# EAGLE design smartsensor (EAGLE 7.4.0)
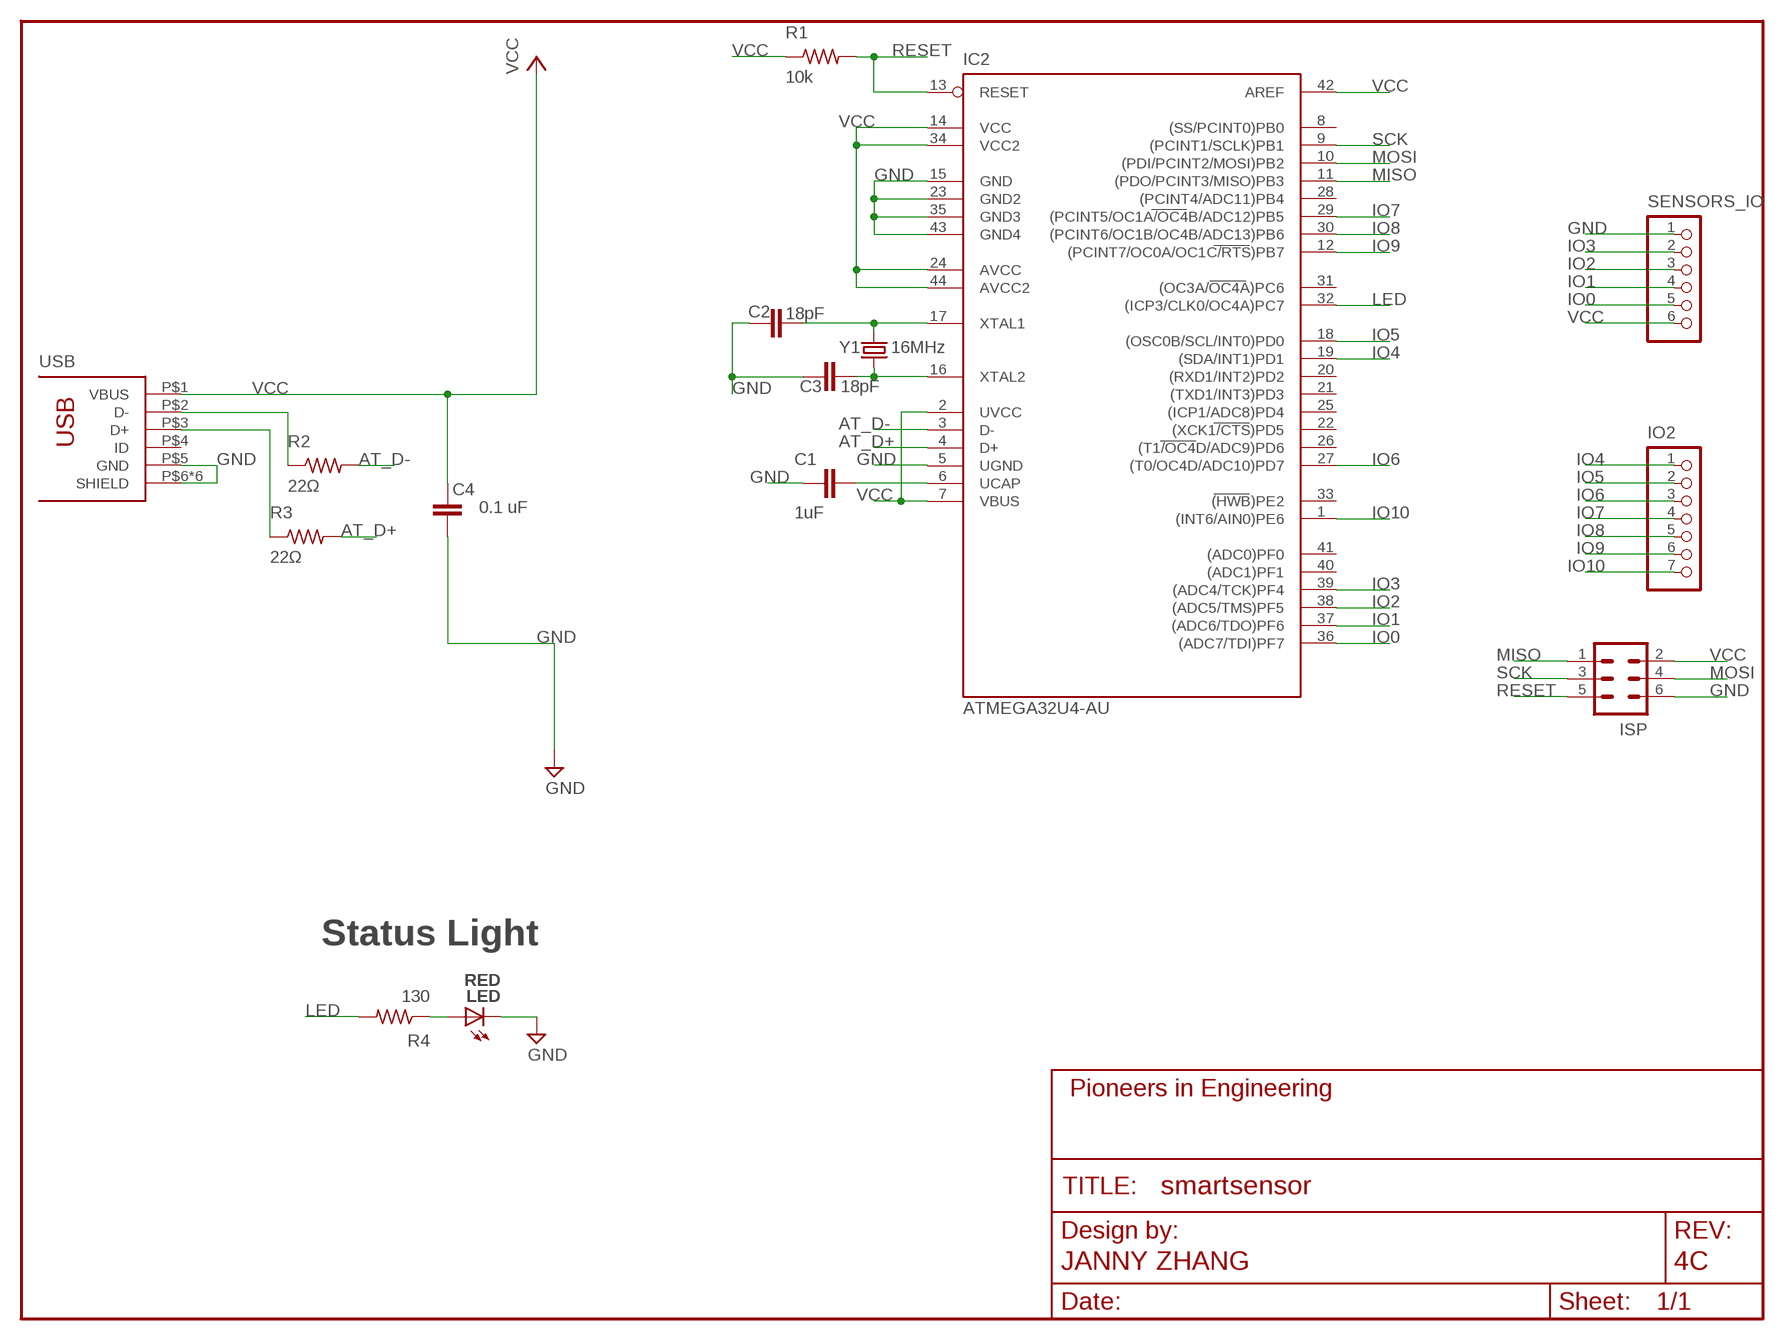
[diagram p0: schematic, sheet 1]
FRAME1 (FRAME-LETTER): AUTHOR: JANNY ZHANG; REVISION: 4C

## Parts
C1  1uF  CAP0603-CAP  [0603-CAP]
C2  18pF  CAP0603-CAP  [0603-CAP]
C3  18pF  CAP0603-CAP  [0603-CAP]
C4  0.1 uF  CAP0603-CAP  [0603-CAP]
IC2  ATMEGA32U4-AU  [TQFP44]
IO2  PINHD-1X7  [1X07]
ISP  MA03-2  [MA03-2]
LED  RED  LED0805  [LED-0805]
R1  10k  R-US_R0603  [R0603]
R2  22Ω  R-US_R0603  [R0603]
R3  22Ω  R-US_R0603  [R0603]
R4  130  R-US_R0603  [R0603]
SENSORS_IO  PINHD-1X6STRAIN-RELIEF  [1X06-STRAINRELIEF]
USB  USB-OTGMICRO-AB  [USB-MICRO-AB]
Y1  16MHz  CRYSTAL5.0X3.2  [CRYSTAL-SMD-5.0X3.2-2PIN]

## Nets
AT_D+: IC2.4(D+) R3.2
AT_D-: IC2.3(D-) R2.2
GND: C1.1 C2.1 C3.1 C4.1 IC2.5(UGND) IC2.15(GND) IC2.23(GND2) IC2.35(GND3) IC2.43(GND4) ISP.6 LED.C SENSORS_IO.1 USB.P$5(GND) USB.P$6(SHIELD) USB.P$7(SHIELD) USB.P$8(SHIELD) USB.P$9(SHIELD) USB.P$10(SHIELD) USB.P$11(SHIELD)
IO0: IC2.36((ADC7/TDI)PF7) SENSORS_IO.5
IO1: IC2.37((ADC6/TDO)PF6) SENSORS_IO.4
IO2: IC2.38((ADC5/TMS)PF5) SENSORS_IO.3
IO3: IC2.39((ADC4/TCK)PF4) SENSORS_IO.2
IO4: IC2.19((SDA/INT1)PD1) IO2.1
IO5: IC2.18((OSC0B/SCL/INT0)PD0) IO2.2
IO6: IC2.27((T0/OC4D/ADC10)PD7) IO2.3
IO7: IC2.29((PCINT5/OC1A/OC4B/ADC12)PB5) IO2.4
IO8: IC2.30((PCINT6/OC1B/OC4B/ADC13)PB6) IO2.5
IO9: IC2.12((PCINT7/OC0A/OC1C/RTS)PB7) IO2.6
IO10: IC2.1((INT6/AIN0)PE6) IO2.7
LED: IC2.32((ICP3/CLK0/OC4A)PC7) R4.2
MISO: IC2.11((PDO/PCINT3/MISO)PB3) ISP.1
MOSI: IC2.10((PDI/PCINT2/MOSI)PB2) ISP.4
N$1: C1.2 IC2.6(UCAP)
N$2: R3.1 USB.P$3(D+)
N$4: R2.1 USB.P$2(D-)
N$5: C2.2 IC2.17(XTAL1) Y1.P$2
N$6: C3.2 IC2.16(XTAL2) Y1.P$1
N$7: LED.A R4.1
RESET: IC2.13(RESET) ISP.5 R1.2
SCK: IC2.9((PCINT1/SCLK)PB1) ISP.3
VCC: C4.2 IC2.2(UVCC) IC2.7(VBUS) IC2.14(VCC) IC2.24(AVCC) IC2.34(VCC2) IC2.42(AREF) IC2.44(AVCC2) ISP.2 R1.1 SENSORS_IO.6 USB.P$1(VBUS)
Unconnected: IC2.8((SS/PCINT0)PB0) IC2.20((RXD1/INT2)PD2) IC2.21((TXD1/INT3)PD3) IC2.22((XCK1/CTS)PD5) IC2.25((ICP1/ADC8)PD4) IC2.26((T1/OC4D/ADC9)PD6) IC2.28((PCINT4/ADC11)PB4) IC2.31((OC3A/OC4A)PC6) IC2.33((HWB)PE2) IC2.40((ADC1)PF1) IC2.41((ADC0)PF0) USB.P$4(ID)

## Notes on the sheet
- Status Light

## Library data of the parts
C1-C4 = pie:CAP: Capacitor Standard 0603 ceramic capacitor, and 0.1" leaded capacitor.; PIE-INT-REF-NUM: CAPACITOR-GENERIC
IC2 = pie:ATMEGA32U4-AU; PIE-DIGIKEY-PN-ALT1: ATMEGA32U4-MURCT-ND; PIE-DIGIKEY-PN-PRI: ATMEGA32U4RC-MURCT-ND; PIE-INT-REF-NUM: ATmega32U4
IO2 = pie:PINHD-1X7: 7-pin 0.1-inch header; DIGIKEY-PN: 3M9326-ND
ISP = pie:MA03-2: PIN HEADER; OC_FARNELL: unknown; OC_NEWARK: unknown; PIE-INT-REF-NUM: BULK-STOCK
LED = pie:LED: LEDs Standard schematic elements and footprints for 5mm, 3mm, 1206, and 0603 sized LEDs. 5mm - Spark Fun Electronics SKU : COM-00529 (and others); PIE-INT-REF-NUM: LED
R1-R4 = pie:R-US_: RESISTOR, American symbol; PIE-INT-REF-NUM: RESISTOR-GENERIC
SENSORS_IO = pie:PINHD-1X6: 6-pin 0.1-inch header
USB = pie:USB-OTG: USB Connector OTG connector with ID pin; PIE-INT-REF-NUM: USB
Y1 = pie:CRYSTAL: Various standard crystals. Proven footprints. Spark Fun Electronics SKU : COM-00534

## Board
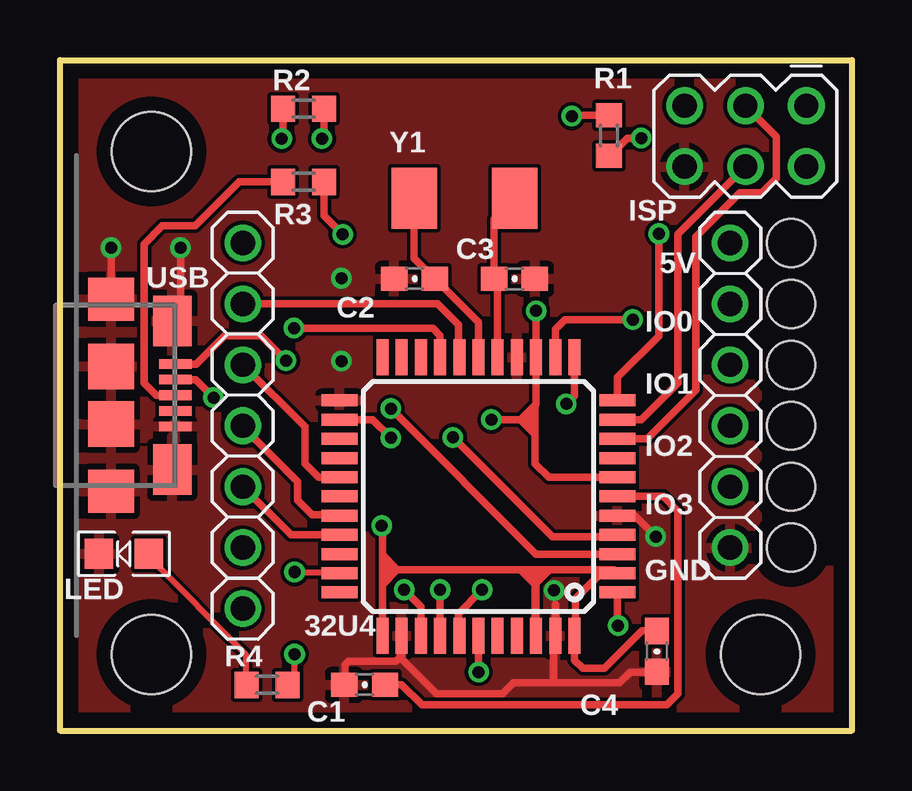
[diagram p1: board, top side]
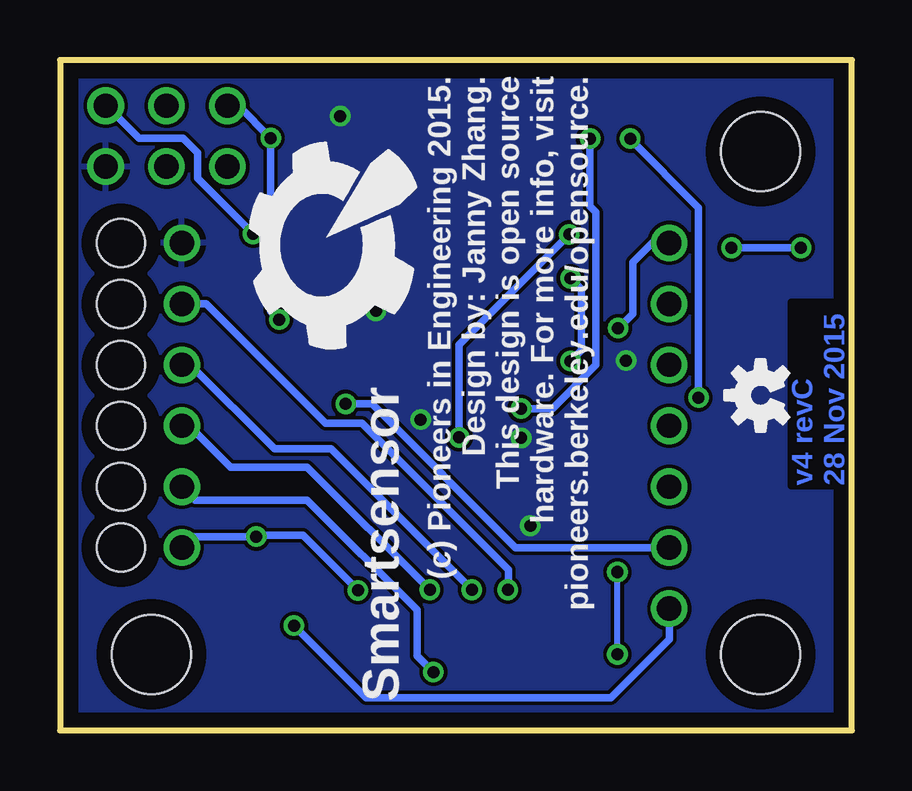
[diagram p2: board, bottom side, seen from below]

Size 33.02 x 27.94 mm. Coordinates in mm from the lower left corner, seen from the top.
Outline: 0,0 0,27.94 33.02,27.94 33.02,0 0,0
Copper layers (1*16): Top 2mil / dielectric 9mil / Bottom 2mil
Design rules "advancedcircuits-33each-pie": minimum track width 6mil, minimum drill 15mil, track to track 6mil, track to pad 6mil, pad to pad 6mil, via to via 6mil, smd to smd 6mil, copper to edge 25mil, drill to drill 7mil, minimum pad ring 7mil, minimum via ring 7mil, stop-mask expansion 3mil, vias tented up to drill 21mil, thermal gap 10mil

### Footprints (pad centres in the part's own frame; a part is rotated, then mirrored left to right if it is on the bottom)
0603-CAP = smd 1.1 x 1: 1 -0.85,0; 2 0.85,0
STAND-OFF = hole 3.302: 0,0
TQFP44 = smd 1.5 x 0.5: 1 -5.8,4; 2 -5.8,3.2; 3 -5.8,2.4; 4 -5.8,1.6; 5 -5.8,0.8; 6 -5.8,0; 7 -5.8,-0.8; 8 -5.8,-1.6; 9 -5.8,-2.4; 10 -5.8,-3.2; 11 -5.8,-4; 23 5.8,-4; 24 5.8,-3.2; 25 5.8,-2.4; 26 5.8,-1.6; 27 5.8,-0.8; 28 5.8,0; 29 5.8,0.8; 30 5.8,1.6; 31 5.8,2.4; 32 5.8,3.2; 33 5.8,4 | smd 0.5 x 1.5: 12 -4,-5.8; 13 -3.2,-5.8; 14 -2.4,-5.8; 15 -1.6,-5.8; 16 -0.8,-5.8; 17 0,-5.8; 18 0.8,-5.8; 19 1.6,-5.8; 20 2.4,-5.8; 21 3.2,-5.8; 22 4,-5.8; 34 4,5.8; 35 3.2,5.8; 36 2.4,5.8; 37 1.6,5.8; 38 0.8,5.8; 39 0,5.8; 40 -0.8,5.8; 41 -1.6,5.8; 42 -2.4,5.8; 43 -3.2,5.8; 44 -4,5.8
1X07 = drill 1.016 pad 1.524: 1 -7.62,0; 2 -5.08,0; 3 -2.54,0; 4 0,0; 5 2.54,0; 6 5.08,0; 7 7.62,0
MA03-2 = drill 1.016 pad 1.524: 1 -2.54,-1.27; 2 -2.54,1.27; 3 0,-1.27; 4 0,1.27; 5 2.54,-1.27; 6 2.54,1.27
LED-0805 = smd 1.194 x 1.245: A -1.041,0; C 1.041,0
R0603 = smd 1 x 1.1: 1 -0.85,0; 2 0.85,0
1X06-STRAINRELIEF = drill 1.016 pad 1.524: 1 -6.35,0; 2 -3.81,0; 3 -1.27,0; 4 1.27,0; 5 3.81,0; 6 6.35,0 | hole 2: -6.35,-2.54; -3.81,-2.54; -1.27,-2.54; 1.27,-2.54; 3.81,-2.54; 6.35,-2.54
USB-MICRO-AB = smd 0.4 x 1.35: P$1 -1.3,1; P$2 -0.65,1; P$3 0,1; P$4 0.65,1; P$5 1.3,1 | smd 2.1 x 1.6: P$6 -3.1,0.875; P$7 3.1,0.875 | smd 1.8 x 1.9: P$8 -4,-1.675; P$9 4,-1.675 | smd 1.9 x 1.9: P$10 -1.2,-1.675; P$11 1.2,-1.675
CRYSTAL-SMD-5.0X3.2-2PIN = smd 1.905 x 2.54: P$1 -2.095,0; P$2 2.095,0

### Placement (x,y rotation side)
C1  12.7,1.91 0 top
C2  14.78,18.82 0 top
C3  18.95,18.82 180 top
C4  24.89,3.3 90 top
HOLE1  [STAND-OFF]  3.81,24.13 0 top
HOLE2  [STAND-OFF]  29.21,3.17 0 top
HOLE3  [STAND-OFF]  3.81,3.17 90 top
IC2  17.45,9.75 180 top
IO2  7.62,12.7 270 top
ISP  28.57,24.77 180 top
LED  2.67,7.37 180 top
R1  22.89,24.79 270 top
R2  10.16,25.91 0 top
R3  10.16,22.86 0 top
R4  8.64,1.91 0 top
SENSORS_IO  27.94,13.97 90 top
U$1  [PIE-LOGO-SMALL]  21.95,20.52 90 bottom
U$2  [OSHW-LOGO-S]  3.81,13.97 90 bottom
USB  3.81,13.97 270 top
Y1  16.87,22.17 180 top

### Tracks (layer width: path | path; a pad name or v marks a point on that pad's centre or on a via)
AT_D+  (via drill 0.5)
  Top 0.305: IC2.4 23.17,8.08 20.52,8.08 v16.38,12.22 | R3.2 11.01,21.45 v11.79,20.68
  Bottom 0.305: v16.38,12.22 16.38,16.08 v11.79,20.68
AT_D-  (via drill 0.5)
  Top 0.305: IC2.3 19.85,7.35 v13.79,13.41 | R2.2 11.01,24.75 v10.92,24.66
  Bottom 0.305: v13.79,13.41 12.5,13.41 10.67,15.24 10.67,21.59 10.92,21.84 v10.92,24.66
GND  (via drill 0.5)
  Top 0.305: 2.23,12.67 USB.P$11 | 4.81,10.99 USB.P$7 | 2.29,10.12 USB.P$9 | 11.77,1.98 C1.1 11.89,1.94 11.89,2.74 12.04,2.9 14.02,2.9 14.17,3.05 | 14.17,3.05 14.25,3.12 IC2.35 14.17,3.88 14.17,3.05 | v5.03,20.12 5.03,17.41 USB.P$6 | 11.61,13.72 IC2.23 11.73,13.84 | 14.17,3.05 15.7,1.52 18.44,1.52 18.91,2 20.57,2 | 20.57,2 20.57,3.88 IC2.43 20.65,5.26 | IC2.5 23.96,8.95 v24.84,8.08 | 20.57,2 23.33,2 23.77,2.44 24.88,2.44 C4.1 | USB.P$8 v2.13,20.11 v2.13,20.12
  Bottom 0.305: v11.73,15.39 11.28,15.85 11.28,18.39 v11.73,18.85 | SENSORS_IO.1 27.48,8.08 v24.84,8.08 24.54,8.08 | v2.13,20.12 v5.03,20.12 | v20.6,5.84 22.89,8.13 24.77,8.13
  pour Top: 0,0 0,27.94 33.02,27.94 33.02,25.4 33.02,0
IO0  (via drill 0.5)
  Top 0.305: IC2.36 15.05,5.17 v14.35,5.87
  Bottom 0.305: SENSORS_IO.5 26.92,17.78 21.95,12.8 20.42,12.8 14.33,6.71 14.33,5.89 v14.35,5.87
IO1  (via drill 0.5)
  Top 0.305: IC2.37 | IC2.37 v15.85,5.87
  Bottom 0.305: v15.85,5.87 21.72,11.73 24.08,11.73 27.58,15.24 SENSORS_IO.4
IO2  (via drill 0.5)
  Top 0.305: IC2.38 16.61,3.99 16.61,4.88 v17.6,5.87
  Bottom 0.305: v17.6,5.87 22.71,10.97 25.91,10.97 27.64,12.7 SENSORS_IO.3
IO3  (via drill 0.5)
  Top 0.305: IC2.39 v17.45,2.44
  Bottom 0.305: SENSORS_IO.2 27.38,9.6 22.71,9.6 18.14,5.03 18.14,3.12 v17.45,2.44
IO4  (via drill 0.5)
  Top 0.305: IC2.19 | IC2.19 15.85,16.46 15.54,16.76 v9.75,16.76
  Bottom 0.305: v9.75,16.76 9.14,17.37 9.14,19.51 8.33,20.32 IO2.1
IO5
  Top 0.305: IC2.18 16.61,15.59 16.61,16.92 15.75,17.78 IO2.2
IO6
  Top 0.305: IC2.27 10.78,10.55 10.21,11.12 10.21,12.65 IO2.3
IO7
  Top 0.305: IO2.4 7.62,12.65 9.91,10.36 9.91,9.6 10.52,8.99 11.61,8.99 IC2.29
IO8
  Top 0.305: IO2.5 9.63,8.15 IC2.30
IO9  (via drill 0.5)
  Top 0.305: v21.11,13.61 21.45,13.96 IC2.12
  Bottom 0.305: IO2.6 14.02,7.62 20.02,13.61 v21.11,13.61
IO10  (via drill 0.5)
  Top 0.305: 23.32,5.69 IC2.1 23.25,4.35 v23.27,4.37
  Bottom 0.305: IO2.7 7.62,3.81 10.06,1.37 20.27,1.37 v23.27,4.37
LED  (via drill 0.51)
  Top 0.254: R4.2 9.78,1.91 v9.78,3.17 | v9.78,6.6 11.65,6.6 IC2.32
  Bottom 0.254: v9.78,3.17 v9.78,6.6
MISO  (via drill 0.5)
  Top 0.305: v24.97,20.7 24.97,16.43 23.25,14.71 IC2.11
  Bottom 0.305: v24.97,20.7 27.28,23.01 27.28,24.08 27.89,24.69 29.72,24.69 31.06,26.04 ISP.1
MOSI
  Top 0.305: IC2.10 24.23,12.95 25.76,14.48 25.76,20.68 ISP.4
N$1
  Top 0.305: C1.2 14.25,1.91 15.09,1.07 25.3,1.07 25.76,1.52 25.76,9.14 25.15,9.75 IC2.6
N$2
  Top 0.305: USB.P$3 4.01,13.97 3.5,14.48 3.5,20.27 4.27,21.03 5.64,21.03 7.47,22.86 R3.1
N$4  (via drill 0.5)
  Top 0.305: USB.P$2 5.65,14.62 v6.4,13.87 | R2.1 9.31,24.73 v9.25,24.66
  Bottom 0.305: v6.4,13.87 6.4,21.79 9.25,24.64 v9.25,24.66
N$5
  Top 0.305: Y1.P$2 14.77,19.68 C2.2 17.45,17 IC2.17
N$6
  Top 0.305: IC2.16 18.25,18.67 C3.2 18.1,21.31 Y1.P$1
N$7
  Top 0.254: LED.A 3.71,7.21 7.75,3.17 7.75,1.94 R4.1
RESET  (via drill 0.5)
  Top 0.305: 22.86,23.91 R1.2 22.9,23.93 23.66,24.69 v24.23,24.69 | IC2.13 20.65,16.71 21.06,17.12 v23.88,17.12
  Bottom 0.305: ISP.5 25.58,26.04 v24.23,24.69 24.23,17.48 v23.88,17.12
SCK
  Top 0.305: IC2.9 24.5,12.15 26.52,14.17 26.52,20.57 28.35,22.4 29.26,22.4 29.87,23.01 29.87,24.74 ISP.3
VCC  (via drill 0.5)
  Top 0.305: USB.P$1 5.67,15.27 6.86,16.46 8.38,16.46 v9.42,15.42 | IC2.24 | 14.06,6.71 19.2,6.71 | 19.2,6.71 19.81,6.1 19.81,3.99 IC2.42 19.85,6.13 20.27,6.55 | 20.42,6.71 23.1,6.71 IC2.2 22.55,6.55 21.49,5.49 21.49,3.99 IC2.44 21.45,2.93 21.79,2.59 22.71,2.59 24.27,4.15 C4.2 24.69,3.95 | 19.81,13.56 19.2,12.95 | 19.2,12.95 v17.98,12.95 | 22.9,10.55 IC2.7 20.38,10.55 19.81,11.12 19.81,12.34 | v21.34,25.6 21.37,25.64 R1.1 | 19.81,13.56 19.85,13.6 IC2.14 v19.85,17.49 | 19.81,13.56 19.81,12.34 | 19.2,12.95 19.66,12.5 | 19.81,12.34 19.66,12.5 | 19.66,12.5 19.66,13.26 19.36,12.95 19.51,12.8 | 19.2,6.71 20.42,6.71 | 20.42,6.71 20.27,6.55 | 20.27,6.55 19.51,6.55 19.66,6.4 19.81,6.4 | IC2.34 13.45,7.32 | 13.45,7.32 13.45,8.5 v13.41,8.53 | 14.06,6.71 13.45,7.32 | 14.06,6.71 14.06,6.69 13.46,6.1 13.46,6.35 13.72,6.6 13.72,6.86 | IC2.24 13.03,12.95 v13.79,12.19
  pour Bottom: 0,0 0,27.94 33.02,27.94 33.02,25.4 33.02,0

### Text on the board
Bottom: v4 revC / 28 Nov 2015
tPlace: 32U4
bPlace: (c) Pioneers in Engineering 2015. / Design by: Janny Zhang. / This design is open source / hardware. For more info, visit / pioneers.berkeley.edu/opensource. | Smartsensor
tNames: Y1 | 5V | IO0 | IO1 | IO2 | IO3 | GND
tValues: 0.1uF